# Altium project shed.PrjPcb
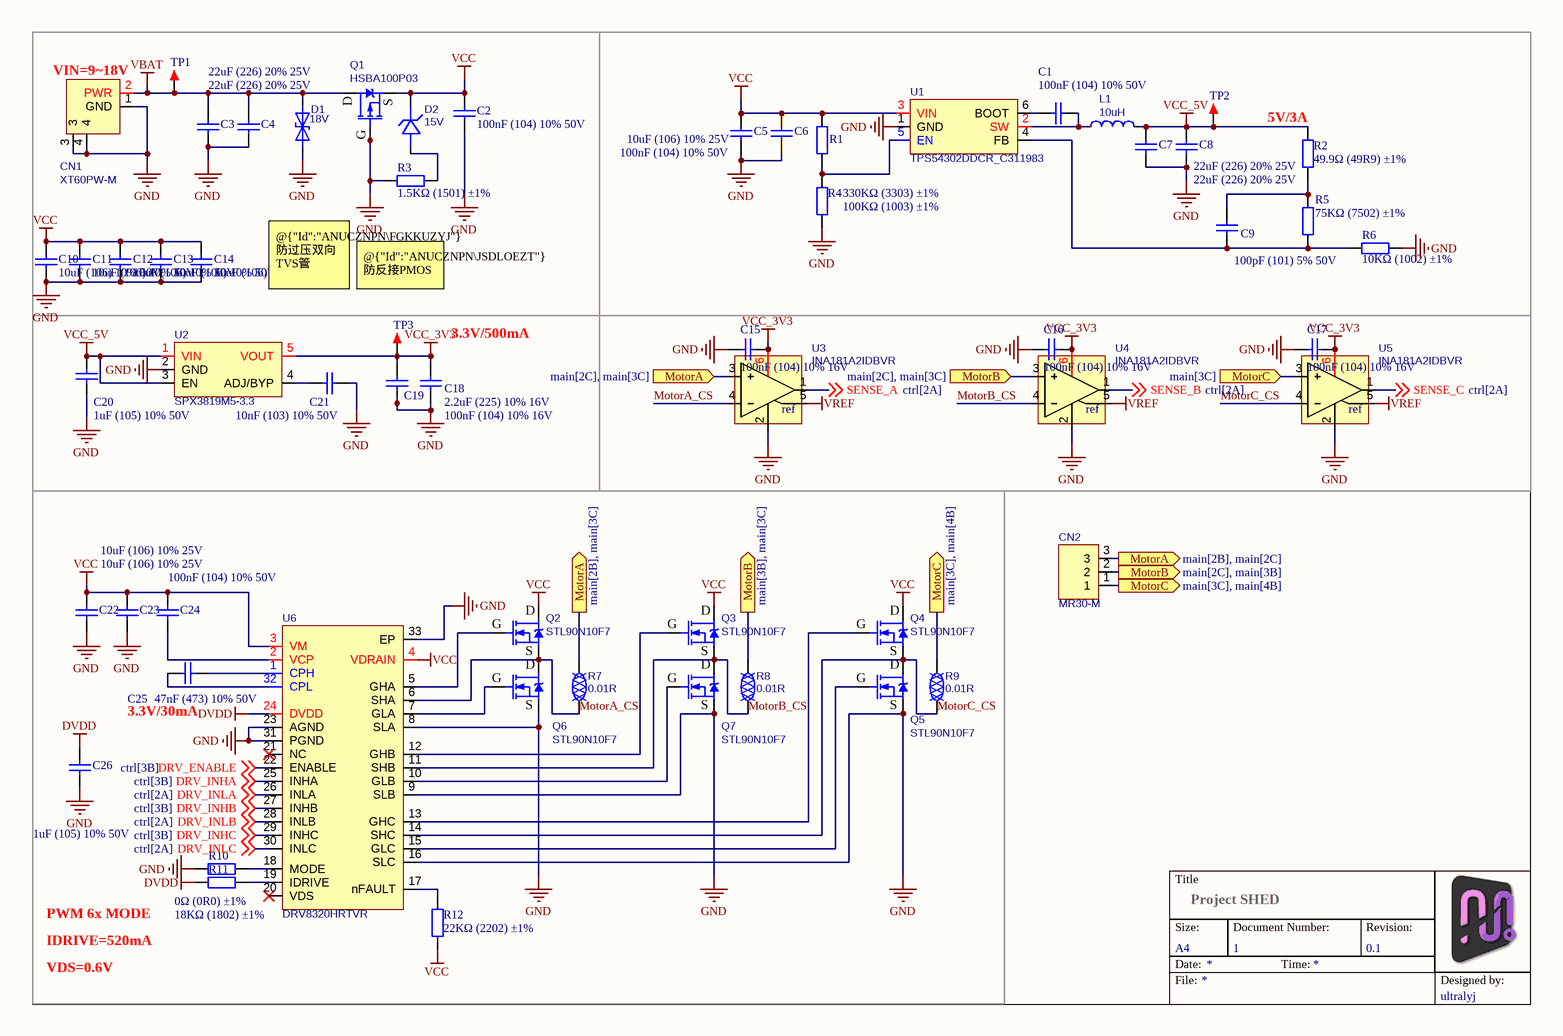
[diagram p0: main.SchDoc]
2 sheets, 110 parts. Net scope: flat (ports and power ports of the same name join across sheets).
Board file: shed.PcbDoc
Sheets:
  main.SchDoc
  ctrl.SchDoc

## Sheet main.SchDoc: Project SHED
size A4; DrawnBy: ultralyj; DocumentNumber: 1; Revision: 0.1; SheetNumber: 1; SheetTotal: 2

### Parts
(Parts that share a designator on the sheet are numbered #1, #2 ... from top to bottom, then left to right.)
C1  100nF (104) 10% 50V  [LC-0603_C_NOSILK]
C2  100nF (104) 10% 50V  [LC-0603_C_NOSILK]
C3  22uF (226) 20% 25V  [LC-0805_C_NOSILK]
C4  22uF (226) 20% 25V  [LC-0805_C_NOSILK]
C5  10uF (106) 10% 25V  [LC-0805_C_NOSILK]
C6  100nF (104) 10% 50V  [LC-0603_C_NOSILK]
C7  22uF (226) 20% 25V  [LC-0805_C_NOSILK]
C8  22uF (226) 20% 25V  [LC-0805_C_NOSILK]
C9  100pF (101) 5% 50V  [LC-0402_C_NOSILK]
C10  10uF (106) 10% 50V  [1206_C]
C11  10uF (106) 10% 50V  [1206_C]
C12  10uF (106) 10% 50V  [1206_C]
C13  10uF (106) 10% 50V  [1206_C]
C14  10uF (106) 10% 50V  [1206_C]
C15  100nF (104) 10% 16V  [LC-0402_C_NOSILK]
C16  100nF (104) 10% 16V  [LC-0402_C_NOSILK]
C17  100nF (104) 10% 16V  [LC-0402_C_NOSILK]
C18  2.2uF (225) 10% 16V  [LC-0603_C_NOSILK]
C19#1  100nF (104) 10% 16V  [LC-0402_C_NOSILK]
C20#1  1uF (105) 10% 50V  [LC-0603_C_NOSILK]
C21#1  10nF (103) 10% 50V  [LC-0402_C_NOSILK]
C22#1  10uF (106) 10% 25V  [LC-0805_C_NOSILK]
C23#1  10uF (106) 10% 25V  [LC-0805_C_NOSILK]
C24#1  100nF (104) 10% 50V  [LC-0603_C_NOSILK]
C25#1  47nF (473) 10% 50V  [LC-0603_C_NOSILK]
C26#1  1uF (105) 10% 50V  [LC-0603_C_NOSILK]
CN1  XT60PW-M  [CONN-TH_XT60PW-M]
CN2  MR30-M  [AMASS-MR30-M]
D1  18V  [SMB_L4.6-W3.6-LS5.3-BI]
D2  15V  [SOD-323_L1.8-W1.3-LS2.5-RD]
L1  10uH  [IND-SMD_L5.4-W5.2]
Q1  HSBA100P03  [DFN-8_L5.7-W5.1-P1.27-LS6.1-BL]
Q2  STL90N10F7  [POWERFLAT-8_L5.2-W6.0-P1.27-LS6.2-BL]
Q3  STL90N10F7  [POWERFLAT-8_L5.2-W6.0-P1.27-LS6.2-BL]
Q4  STL90N10F7  [POWERFLAT-8_L5.2-W6.0-P1.27-LS6.2-BL]
Q5  STL90N10F7  [POWERFLAT-8_L5.2-W6.0-P1.27-LS6.2-BL]
Q6  STL90N10F7  [POWERFLAT-8_L5.2-W6.0-P1.27-LS6.2-BL]
Q7  STL90N10F7  [POWERFLAT-8_L5.2-W6.0-P1.27-LS6.2-BL]
R1  330KΩ (3303) ±1%  [LC-0402_R_NOSILK]
R2  49.9Ω (49R9) ±1%  [LC-0402_R_NOSILK]
R3  1.5KΩ (1501) ±1%  [LC-0402_R_NOSILK]
R4  100KΩ (1003) ±1%  [LC-0402_R_NOSILK]
R5  75KΩ (7502) ±1%  [LC-0402_R_NOSILK]
R6  10KΩ (1002) ±1%  [LC-0402_R_NOSILK]
R7  0.01R  [RES-SMD_L6.4-W3.2_RLP25]
R8  0.01R  [RES-SMD_L6.4-W3.2_RLP25]
R9  0.01R  [RES-SMD_L6.4-W3.2_RLP25]
R10  0Ω (0R0) ±1%  [LC-0402_R_NOSILK]
R11  18KΩ (1802) ±1%  [LC-0402_R_NOSILK]
R12  22KΩ (2202) ±1%  [LC-0402_R_NOSILK]
TP1  TEST  [TEST 1.6]  (value not drawn)
TP2  TEST  [TEST 1.6]  (value not drawn)
TP3  TEST  [TEST 1.6]  (value not drawn)
U1  TPS54302DDCR_C311983  [SOT-23-6_L2.9-W1.6-P0.95-LS2.8-BL]
U2  SPX3819M5-3.3  [SOT-23-5_L2.9-W1.6-P0.95-LS2.8-BL]
U3  INA181A2IDBVR  [SOT-23-6_L2.9-W1.6-P0.95-LS2.8-BL]
U4  INA181A2IDBVR  [SOT-23-6_L2.9-W1.6-P0.95-LS2.8-BL]
U5  INA181A2IDBVR  [SOT-23-6_L2.9-W1.6-P0.95-LS2.8-BL]
U6  DRV8320HRTVR  [QFN-32_L5.0-W5.0-P0.50-TL-EP3.5]

### Blocks framed on the sheet
VIN=9~18V: C2-C4 C10-C14 CN1 D1 D2 Q1 R3 TP1
5V/3A: C1 C5-C9 L1 R1 R2 R4-R6 TP2 U1
3.3V/500mA: C18 C19#1 C20#1 C21#1 TP3 U2

### Ports
MotorA (in, see main[2C], main[3C]), MotorA (out, see main[2B], main[2C]), MotorA (out, see main[2B], main[3C]), MotorB (in, see main[2C], main[3C]), MotorB (out, see main[2C], main[3B]), MotorB (out, see main[3B], main[3C]), MotorC (in, see main[3C]), MotorC (out, see main[3C], main[4B])

### Nets
DVDD: C26#1.2 R11.1 U6.24(DVDD)
GND: C2.1 C3.1 C4.1 C5.1 C6.1 C7.1 C8.1 C10.1 C11.1 C12.1 C13.1 C14.1 C15.1 C16.1 C17.1 C18.1 C19#1.1 C20#1.1 C21#1.2 C22#1.1 C23#1.1 C26#1.1 CN1.1(GND) CN1.3 CN1.4 D1.1 Q1.4(G) Q5.1,2,3(S) Q6.1,2,3(S) Q7.1,2,3(S) R3.1 R4.1 R6.1 R10.1 U1.1(GND) U2.2(GND) U3.2(GND) U4.2(GND) U5.2(GND) U6.8(SLA) U6.9(SLB) U6.16(SLC) U6.23(AGND) U6.31(PGND) U6.33(EP)
VBAT: C3.2 C4.2 CN1.2(PWR) D1.2 Q1.5,6,7,8,9(D) TP1.1
VCC: C2.2 C5.2 C6.2 C10.2 C11.2 C12.2 C13.2 C14.2 C22#1.2 C23#1.2 C24#1.2 D2.1 Q1.1,2,3(S) Q2.5,6,7,8(D) Q3.5,6,7,8(D) Q4.5,6,7,8(D) R1.2 R12.2 U1.3(VIN) U6.3(VM) U6.4(VDRAIN)
VCC_3V3: C15.2 C16.2 C17.2 C18.2 C19#1.2 TP3.1 U2.5(VOUT) U3.6(VS) U4.6(VS) U5.6(VS)
VCC_5V: C7.2 C8.2 C20#1.2 L1.2 R2.2 TP2.1 U2.1(VIN) U2.3(EN)
VREF: U3.5(REF) U4.5(REF) U5.5(REF)
DRV_ENABLE: U6.22(ENABLE) ; off-sheet DRV_ENABLE
DRV_INHA: U6.25(INHA) ; off-sheet DRV_INHA
DRV_INHB: U6.27(INHB) ; off-sheet DRV_INHB
DRV_INHC: U6.29(INHC) ; off-sheet DRV_INHC
DRV_INLA: U6.26(INLA) ; off-sheet DRV_INLA
DRV_INLB: U6.28(INLB) ; off-sheet DRV_INLB
DRV_INLC: U6.30(INLC) ; off-sheet DRV_INLC
MotorA_CS: Q2.1,2,3(S) Q6.5,6,7,8(D) R7.1 U3.4(IN-) U6.6(SHA)
MotorB_CS: Q3.1,2,3(S) Q7.5,6,7,8(D) R8.1 U4.4(IN-) U6.11(SHB)
MotorC_CS: Q4.1,2,3(S) Q5.5,6,7,8(D) R9.2 U5.4(IN-) U6.14(SHC)
SENSE_A: U3.1(OUT) ; off-sheet SENSE_A
SENSE_B: U4.1(OUT) ; off-sheet SENSE_B
SENSE_C: U5.1(OUT) ; off-sheet SENSE_C
NetC1_1: C1.1 U1.6(BOOT)
NetC1_2: C1.2 L1.1 U1.2(SW)
NetC9_1: C9.1 R5.1 R6.2 U1.4(FB)
NetC9_2: C9.2 R2.1 R5.2
NetC21#1_1: C21#1.1 U2.4(ADJ/BYP)
NetC24#1_1: C24#1.1 U6.2(VCP)
NetC25#1_1: C25#1.1 U6.32(CPL)
NetC25#1_2: C25#1.2 U6.1(CPH)
NetCN2_1: CN2.1 R9.1 U5.3(IN+) ; port MotorC
NetCN2_2: CN2.2 R8.2 U4.3(IN+) ; port MotorB
NetCN2_3: CN2.3 R7.2 U3.3(IN+) ; port MotorA
NetD2_2: D2.2 R3.2
NetQ2_4: Q2.4(G) U6.5(GHA)
NetQ3_4: Q3.4(G) U6.12(GHB)
NetQ4_4: Q4.4(G) U6.13(GHC)
NetQ5_4: Q5.4(G) U6.15(GLC)
NetQ6_4: Q6.4(G) U6.7(GLA)
NetQ7_4: Q7.4(G) U6.10(GLB)
NetR1_1: R1.1 R4.2 U1.5(EN)
NetR10_2: R10.2 U6.18(MODE)
NetR11_2: R11.2 U6.19(IDRIVE)
NetR12_1: R12.1 U6.17(nFAULT)

Not connected (* = marked no-connect by the designer): U6 20(VDS)* 21(NC)*

### Notes on the sheet
- @{"Id":"ANUCZNPN\FGKKUZYJ"} 防过压双向TVS管
- @{"Id":"ANUCZNPN\JSDLOEZT"} 防反接PMOS
- (near C25#1) 3.3V/30mA
- PWM 6x MODE
- IDRIVE=520mA
- VDS=0.6V
- Title
- Size:
- A4
- Date:
- File:
- Document Number:
- Time:
- Revision:
- Designed by:
- (in symbol INA181A2IDBVR) ref

### Library data of the parts
C1 C2 C6 C24#1 = 0603 100nF (104) 10% 50V: 贴片电容; ComponentLink1Description: 供应商链接; ComponentLink1URL: http://www.szlcsc.com/product/details_15331.html; Package: 0603; Supplier: LC; SuppliersPartNumber: C14663
C3 C4 C7 C8 = 0805 22uF (226) 20% 25V: 贴片电容; ComponentLink1Description: 供应商链接; ComponentLink1URL: http://www.szlcsc.com/product/details_46786.html; Package: 0805; Supplier: LC; SuppliersPartNumber: C45783
C5 C22#1 C23#1 = 0805 10uF (106) 10% 25V: 贴片电容; ComponentLink1Description: 供应商链接; ComponentLink1URL: http://www.szlcsc.com/product/details_16532.html; Package: 0805; Supplier: LC; SuppliersPartNumber: C15850
C9 = 0402 100pF (101) 5% 50V: 贴片电容; ComponentLink1Description: 供应商链接; ComponentLink1URL: http://www.szlcsc.com/product/details_1898.html; Package: 0402; Supplier: LC; SuppliersPartNumber: C1546
C10-C14 = 1206 10uF (106) 10% 50V: 贴片电容; ComponentLink1Description: 供应商链接; ComponentLink1URL: http://www.szlcsc.com/product/details_14236.html; Package: 1206; Supplier: LC; SuppliersPartNumber: C13585
C15-C17 C19#1 = 0402 100nF (104) 10% 16V: 贴片电容; ComponentLink1Description: 供应商链接; ComponentLink1URL: http://www.szlcsc.com/product/details_1877.html; Package: 0402; Supplier: LC; SuppliersPartNumber: C1525
C18 = 0603 2.2uF (225) 10% 16V: 贴片电容; ComponentLink1Description: 供应商链接; ComponentLink1URL: http://www.szlcsc.com/product/details_24366.html; Package: 0603; Supplier: LC; SuppliersPartNumber: C23630
C20#1 C26#1 = 0603 1uF (105) 10% 50V: 贴片电容; ComponentLink1Description: 供应商链接; ComponentLink1URL: http://www.szlcsc.com/product/details_16531.html; Package: 0603; Supplier: LC; SuppliersPartNumber: C15849
C21#1 = 0402 10nF (103) 10% 50V: 贴片电容; ComponentLink1Description: 供应商链接; ComponentLink1URL: http://www.szlcsc.com/product/details_15869.html; Package: 0402; Supplier: LC; SuppliersPartNumber: C15195
C25#1 = 0603 47nF (473) 10% 50V: 贴片电容; ComponentLink1Description: 供应商链接; ComponentLink1URL: http://www.szlcsc.com/product/details_1974.html; Package: 0603; Supplier: LC; SuppliersPartNumber: C1622
CN1 = XT60PW-M: 电源插座; BOM_Manufacturer: AMASS(艾迈斯); Contributor: LCSC; BOM_Supplier: LCSC; BOM_Supplier Part: C98732; BOM_Manufacturer Part: XT60PW-M; BOM_JLCPCB Part Class: Extended Part; spicePre: C; spiceSymbolName: XT60PW-M
CN2 = MR30-M: 三芯XT插头连接器Male; BOM_Manufacturer: AMASS(艾迈斯); Contributor: lcsc; BOM_Supplier: LCSC; BOM_Supplier Part: C99873; BOM_Manufacturer Part: MR30-M; link: https://atta.szlcsc.com/upload/public/pdf/source/20170412/1491969315720.pdf; BOM_JLCPCB Part Class: Extended Part; spicePre: U; spiceSymbolName: MR30-M
D1 = SMBJ18CA-C78413: 双向18V TVS管; BOM_Manufacturer Part: SMBJ18CA/TR13; BOM_Manufacturer: Brightking(君耀电子); BOM_Supplier: LCSC; BOM_Supplier Part: C78413; BOM_JLCPCB Part Class: Extended Part; spicePre: D; spiceSymbolName: SMBJ18CA-C78413
D2 = PTVSHC3D15VUH: 15V TVS管; BOM_Manufacturer: Prisemi(芯导); Contributor: LCSC; BOM_Supplier: LCSC; BOM_Supplier Part: C312234; BOM_Manufacturer Part: PTVSHC3D15VUH; BOM_JLCPCB Part Class: Extended Part; spicePre: D; spiceSymbolName: PTVSHC3D15VUH
L1 = 10uH: YSPI0530-100M 2.5A功率电感; BOM_Manufacturer: YJYCOIN(益嘉源); nameAlias: Inductance; Contributor: LCSC; BOM_Supplier: LCSC; BOM_Supplier Part: C351099; BOM_Manufacturer Part: YSPI0530-100M; BOM_JLCPCB Part Class: Extended Part; spicePre: L; spiceSymbolName: YSPI0530-100M
Q1 = HSBA100P03: P-Channel Mosfet Vdss=30V Id=100A; BOM_Manufacturer: HUASHUO(华朔); Contributor: LCSC; BOM_Supplier: LCSC; BOM_Supplier Part: C701057; BOM_Manufacturer Part: HSBA100P03; BOM_JLCPCB Part Class: Extended Part; spicePre: Q; spiceSymbolName: HSBA100P03
Q2-Q7 = STL90N10F7: N-Channel Mosfet Vdss=100V Id=70A; BOM_Manufacturer: ST(意法半导体); Contributor: LCSC; BOM_Supplier: LCSC; BOM_Supplier Part: C457493; BOM_Manufacturer Part: STL90N10F7; BOM_JLCPCB Part Class: Extended Part; spicePre: Q; spiceSymbolName: STL90N10F7
R1 = 0402 330KΩ (3303) 1%: 贴片电阻; ComponentLink1Description: 供应商链接; ComponentLink1URL: http://www.szlcsc.com/product/details_26521.html; Package: 0402; Supplier: LC; SuppliersPartNumber: C25778
R2 = 0402 49.9Ω (49R9) 1%: 贴片电阻; ComponentLink1Description: 供应商链接; ComponentLink1URL: http://www.szlcsc.com/product/details_25863.html; Package: 0402; Supplier: LC; SuppliersPartNumber: C25120
R3 = 0402 1.5KΩ (1501) 1%: 贴片电阻; ComponentLink1Description: 供应商链接; ComponentLink1URL: http://www.szlcsc.com/product/details_26610.html; Package: 0402; Supplier: LC; SuppliersPartNumber: C25867
R4 = 0402 100KΩ (1003) 1%: 贴片电阻; ComponentLink1Description: 供应商链接; ComponentLink1URL: http://www.szlcsc.com/product/details_26484.html; Package: 0402; Supplier: LC; SuppliersPartNumber: C25741
R5 = 0402 75KΩ (7502) 1%: 贴片电阻; ComponentLink1Description: 供应商链接; ComponentLink1URL: http://www.szlcsc.com/product/details_26541.html; Package: 0402; Supplier: LC; SuppliersPartNumber: C25798
R6 = 0402 10KΩ (1002) 1%: 贴片电阻; ComponentLink1Description: 供应商链接; ComponentLink1URL: http://www.szlcsc.com/product/details_26487.html; Package: 0402; Supplier: LC; SuppliersPartNumber: C25744
R7-R9 = PA2512FKF7T0R001E: 0.01欧姆采样电阻 3W; BOM_Manufacturer: YAGEO(国巨); Contributor: lcsc; BOM_Supplier: LCSC; BOM_Supplier Part: C723380; BOM_Manufacturer Part: PA2512FKF7T0R001E; Resistance: -; BOM_JLCPCB Part Class: Extended Part; spicePre: R; spiceSymbolName: PA2512FKF7T0R001E
R10 = 0402 0Ω (0R0) 1%: 贴片电阻; ComponentLink1Description: 供应商链接; ComponentLink1URL: http://www.szlcsc.com/product/details_17853.html; Package: 0402; Supplier: LC; SuppliersPartNumber: C17168
R11 = 0402 18KΩ (1802) 1%: 贴片电阻; ComponentLink1Description: 供应商链接; ComponentLink1URL: http://www.szlcsc.com/product/details_26505.html; Package: 0402; Supplier: LC; SuppliersPartNumber: C25762
R12 = 0402 22KΩ (2202) 1%: 贴片电阻; ComponentLink1Description: 供应商链接; ComponentLink1URL: http://www.szlcsc.com/product/details_26511.html; Package: 0402; Supplier: LC; SuppliersPartNumber: C25768
TP1-TP3 = TEST: 测试点; 版权归属: 源创客; BOM名称: 测试点; 学习资源: www.ooocke.com
U1 = TPS54302DDCR_C311983: DC-DC芯片 Vin=4.5V~28V Vout=596mV~28V Imax=3A; BOM_Manufacturer: TI(德州仪器); Contributor: LCSC; BOM_Supplier: LCSC; BOM_Supplier Part: C311983; BOM_Manufacturer Part: TPS54302DDCR; BOM_JLCPCB Part Class: Extended Part; spicePre: U; spiceSymbolName: TPS54302DDCR_C311983
U2 = SPX3819M5-3.3: Vin=16V Vout=3.3V 500mA LDO; BOM_Manufacturer: null; Contributor: lcsc; BOM_Supplier: LCSC; BOM_Supplier Part: C9900018941; BOM_Manufacturer Part: SPX3819M5-3.3; BOM_JLCPCB Part Class: Extended Part; spicePre: U; spiceSymbolName: SPX3819M5-3.3
U3-U5 = INA181A2IDBVR: 26V、双向、350kHz 电流感应放大器; BOM_Manufacturer: TI(德州仪器); Contributor: lcsc; BOM_Supplier: LCSC; BOM_Supplier Part: C2058784; BOM_Manufacturer Part: INA181A2IDBVR; BOM_JLCPCB Part Class: Extended Part; spicePre: U; spiceSymbolName: INA181A2IDBVR
U6 = DRV8320HRTVR: 最大 65V 三相智能栅极驱动器; BOM_Manufacturer: TI(德州仪器); Contributor: LCSC; BOM_Supplier: LCSC; BOM_Supplier Part: C701782; BOM_Manufacturer Part: DRV8320HRTVR; BOM_JLCPCB Part Class: Extended Part; spicePre: U; spiceSymbolName: DRV8320HRTVR

## Sheet ctrl.SchDoc: Project SHED
size A4; DrawnBy: ultralyj; DocumentNumber: 2; Revision: 0.1; SheetNumber: 2; SheetTotal: 2
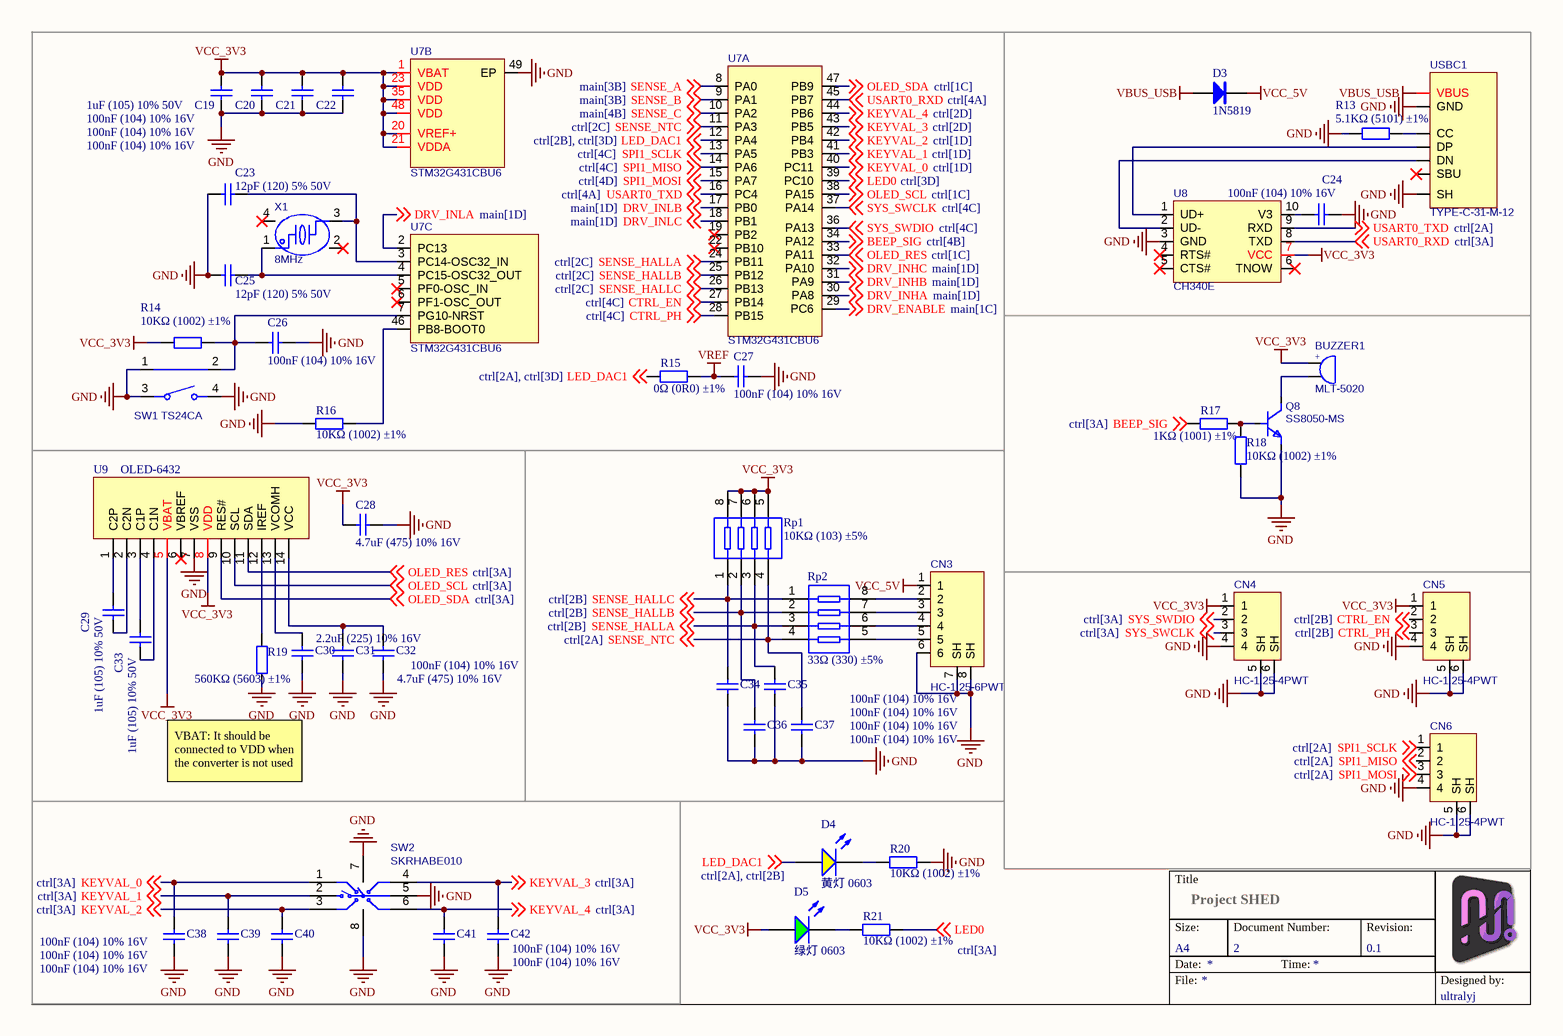
[diagram p1: ctrl.SchDoc]

### Parts
(Parts that share a designator on the sheet are numbered #1, #2 ... from top to bottom, then left to right.)
BUZZER1  MLT-5020  [BUZ-SMD_L5.0-W5.5-P4.60]
C19#2  1uF (105) 10% 50V  [LC-0603_C_NOSILK]
C20#2  100nF (104) 10% 16V  [LC-0402_C_NOSILK]
C21#2  100nF (104) 10% 16V  [LC-0402_C_NOSILK]
C22#2  100nF (104) 10% 16V  [LC-0402_C_NOSILK]
C23#2  12pF (120) 5% 50V  [LC-0402_C_NOSILK]
C24#2  100nF (104) 10% 16V  [LC-0402_C_NOSILK]
C25#2  12pF (120) 5% 50V  [LC-0402_C_NOSILK]
C26#2  100nF (104) 10% 16V  [LC-0402_C_NOSILK]
C27  100nF (104) 10% 16V  [LC-0402_C_NOSILK]
C28  4.7uF (475) 10% 16V  [LC-0603_C_NOSILK]
C29  1uF (105) 10% 50V  [LC-0603_C_NOSILK]
C30  2.2uF (225) 10% 16V  [LC-0603_C_NOSILK]
C31  4.7uF (475) 10% 16V  [LC-0603_C_NOSILK]
C32  100nF (104) 10% 16V  [LC-0402_C_NOSILK]
C33  1uF (105) 10% 50V  [LC-0603_C_NOSILK]
C34  100nF (104) 10% 16V  [LC-0402_C_NOSILK]
C35  100nF (104) 10% 16V  [LC-0402_C_NOSILK]
C36  100nF (104) 10% 16V  [LC-0402_C_NOSILK]
C37  100nF (104) 10% 16V  [LC-0402_C_NOSILK]
C38  100nF (104) 10% 16V  [LC-0402_C_NOSILK]
C39  100nF (104) 10% 16V  [LC-0402_C_NOSILK]
C40  100nF (104) 10% 16V  [LC-0402_C_NOSILK]
C41  100nF (104) 10% 16V  [LC-0402_C_NOSILK]
C42  100nF (104) 10% 16V  [LC-0402_C_NOSILK]
CN3  HC-1.25-6PWT  [CONN-SMD_6P-P1.25_HC-1.25-6PWT]
CN4  HC-1.25-4PWT  [CONN-SMD_4P-P1.25-HC-1.25-4PWT]
CN5  HC-1.25-4PWT  [CONN-SMD_4P-P1.25-HC-1.25-4PWT]
CN6  HC-1.25-4PWT  [CONN-SMD_4P-P1.25-HC-1.25-4PWT]
D3  1N5819  [SOD-323]
D4  黄灯 0603  [0603_LED_S1]
D5  绿灯 0603  [0603_LED_S1]
Q8  SS8050-MS  [SOT-23-3_L2.9-W1.3-P0.95-LS2.4-BR]
R13  5.1KΩ (5101) ±1%  [LC-0402_R_NOSILK]
R14  10KΩ (1002) ±1%  [LC-0402_R_NOSILK]
R15  0Ω (0R0) ±1%  [LC-0402_R_NOSILK]
R16  10KΩ (1002) ±1%  [LC-0402_R_NOSILK]
R17  1KΩ (1001) ±1%  [0402_R]
R18  10KΩ (1002) ±1%  [0402_R]
R19  560KΩ (5603) ±1%  [LC-0603_R_NOSILK]
R20  10KΩ (1002) ±1%  [LC-0402_R_NOSILK]
R21  10KΩ (1002) ±1%  [0402_R]
Rp1  10KΩ (103) ±5%  [0402_Rx4]
Rp2  33Ω (330) ±5%  [0402_Rx4]
SW1  TS24CA  [SW-SMD_TS24CA]
SW2  SKRHABE010  [SW-SMD_SKRHABE010]
U7  STM32G431CBU6  [UFQFPN-48_L7.0-W7.0-P0.50-BL-EP]  (parts A,B,C of 3)
U8  CH340E  [MSOP-10_L3.0-W3.0-P0.50-LS5.0-BL]
U9  OLED-6432  [OLED-6432-TOP]
USBC1  TYPE-C-31-M-12  [USB-C_SMD-TYPE-C-31-M-12]
X1  8MHz  [CRYSTAL-SMD_4P-L3.2-W2.5-BL]

### Nets
GND: C19#2.1 C20#2.1 C21#2.1 C22#2.1 C23#2.1 C24#2.2 C25#2.1 C26#2.2 C27.2 C28.1 C30.1 C31.1 C32.1 C34.1 C35.1 C36.1 C37.1 C38.1 C39.1 C40.1 C41.1 C42.1 CN3.6 CN3.7(SH) CN3.8(SH) CN4.4 CN4.5(SH) CN4.6(SH) CN5.4 CN5.5(SH) CN5.6(SH) CN6.4 CN6.5(SH) CN6.6(SH) Q8.2(E) R13.1 R16.1 R18.1 R19.1 R20.2 SW1.1 SW1.3 SW1.4 SW2.5(COM) SW2.7 SW2.8 U7.49(EP) U8.3(GND) U9.7(VSS) USBC1.0,1,2,3(SH) USBC1.A1,B1,A12,B12(GND)
VBUS_USB: D3.1(A) USBC1.A4,A9,B4,B9(VBUS)
VCC_3V3: BUZZER1.1 C19#2.2 C20#2.2 C21#2.2 C22#2.2 C28.2 CN4.1 CN5.1 D5.A R14.1 Rp1.5 Rp1.6 Rp1.7 Rp1.8 U7.1(VBAT) U7.20(VREF+) U7.21(VDDA) U7.23(VDD) U7.35(VDD) U7.48(VDD) U8.7(VCC) U9.5(VBAT) U9.8(VDD)
VCC_5V: CN3.1 D3.2(K)
VREF: C27.1 R15.2
BEEP_SIG: R17.1 U7.34(PA12) ; off-sheet BEEP_SIG
CTRL_EN: CN5.2 U7.27(PB14) ; off-sheet CTRL_EN
CTRL_PH: CN5.3 U7.28(PB15) ; off-sheet CTRL_PH
DRV_ENABLE: U7.29(PC6) ; off-sheet DRV_ENABLE
DRV_INHA: U7.30(PA8) ; off-sheet DRV_INHA
DRV_INHB: U7.31(PA9) ; off-sheet DRV_INHB
DRV_INHC: U7.32(PA10) ; off-sheet DRV_INHC
DRV_INLA: U7.2(PC13) ; off-sheet DRV_INLA
DRV_INLB: U7.17(PB0) ; off-sheet DRV_INLB
DRV_INLC: U7.18(PB1) ; off-sheet DRV_INLC
KEYVAL_0: C38.2 SW2.1(A) U7.40(PC11) ; off-sheet KEYVAL_0
KEYVAL_1: C39.2 SW2.2(CEN) U7.41(PB3) ; off-sheet KEYVAL_1
KEYVAL_2: C40.2 SW2.3(C) U7.42(PB4) ; off-sheet KEYVAL_2
KEYVAL_3: C42.2 SW2.4(D) U7.43(PB5) ; off-sheet KEYVAL_3
KEYVAL_4: C41.2 SW2.6(B) U7.44(PB6) ; off-sheet KEYVAL_4
LED0: R21.2 U7.39(PC10) ; off-sheet LED0
LED_DAC1: D4.A R15.1 U7.12(PA4) ; off-sheet LED_DAC1
OLED_RES: U7.33(PA11) U9.11(SDA) ; off-sheet OLED_RES
OLED_SCL: U7.38(PA15) U9.10(SCL) ; off-sheet OLED_SCL
OLED_SDA: U7.47(PB9) U9.9(RES#) ; off-sheet OLED_SDA
SENSE_A: U7.8(PA0) ; off-sheet SENSE_A
SENSE_B: U7.9(PA1) ; off-sheet SENSE_B
SENSE_C: U7.10(PA2) ; off-sheet SENSE_C
SENSE_HALLA: C35.2 Rp1.3 Rp2.3 U7.24(PB11) ; off-sheet SENSE_HALLA
SENSE_HALLB: C36.2 Rp1.2 Rp2.2 U7.25(PB12) ; off-sheet SENSE_HALLB
SENSE_HALLC: C34.2 Rp1.1 Rp2.1 U7.26(PB13) ; off-sheet SENSE_HALLC
SENSE_NTC: C37.2 Rp1.4 Rp2.4 U7.11(PA3) ; off-sheet SENSE_NTC
SPI1_MISO: CN6.2 U7.14(PA6) ; off-sheet SPI1_MISO
SPI1_MOSI: CN6.3 U7.15(PA7) ; off-sheet SPI1_MOSI
SPI1_SCLK: CN6.1 U7.13(PA5) ; off-sheet SPI1_SCLK
SYS_SWCLK: CN4.3 U7.37(PA14) ; off-sheet SYS_SWCLK
SYS_SWDIO: CN4.2 U7.36(PA13) ; off-sheet SYS_SWDIO
USART0_RXD: U7.45(PB7) U8.8(TXD) ; off-sheet USART0_RXD
USART0_TXD: U7.16(PC4) U8.9(RXD) ; off-sheet USART0_TXD
NetBUZZER1_2: BUZZER1.2 Q8.3(C)
NetC23#2_2: C23#2.2 U7.3(PC14-OSC32_IN) X1.3
NetC24#2_1: C24#2.1 U8.10(V3)
NetC25#2_2: C25#2.2 U7.4(PC15-OSC32_OUT) X1.1
NetC26#2_1: C26#2.1 R14.2 SW1.2 U7.7(PG10-NRST)
NetC29_1: C29.1 U9.2(C2N)
NetC29_2: C29.2 U9.1(C2P)
NetC30_2: C30.2 U9.13(VCOMH)
NetC31_2: C31.2 C32.2 U9.14(VCC)
NetC33_1: C33.1 U9.4(C1N)
NetC33_2: C33.2 U9.3(C1P)
NetCN3_2: CN3.2 Rp2.8
NetCN3_3: CN3.3 Rp2.7
NetCN3_4: CN3.4 Rp2.6
NetCN3_5: CN3.5 Rp2.5
NetD4_K: D4.K R20.1
NetD5_K: D5.K R21.1
NetQ8_1: Q8.1(B) R17.2 R18.2
NetR13_2: R13.2 USBC1.A5,B5(CC)
NetR16_2: R16.2 U7.46(PB8-BOOT0)
NetR19_2: R19.2 U9.12(IREF)
NetU8_1: U8.1(UD+) USBC1.A6,B6(DP)
NetU8_2: U8.2(UD-) USBC1.A7,B7(DN)

Not connected (* = marked no-connect by the designer): U7 5(PF0-OSC_IN)* 6(PF1-OSC_OUT)* 19(PB2)* 22(PB10)*; U8 4(RTS#)* 5(CTS#)* 6(TNOW)*; U9 6(VBREF)*; USBC1 A8,B8(SBU)*; X1 2(GND)* 4(GND)*

### Notes on the sheet
- VBAT: It should be connected to VDD when the converter is not used
- Title
- Size:
- A4
- Date:
- File:
- Document Number:
- Time:
- Revision:
- Designed by:
- (in symbol MLT-5020) +

### Library data of the parts
BUZZER1 = MLT-5020: 薄款贴片无源蜂鸣器; BOM_Manufacturer: 华能; Frequency: 4000Hz; BOM_Supplier: LCSC; BOM_Manufacturer Part: MLT-5020; BOM_Supplier Part: C94598; BOM_JLCPCB Part Class: Extended Part; spicePre: B; spiceSymbolName: MLT-5020
C19#2 C29 C33 = 0603 1uF (105) 10% 50V: 贴片电容; ComponentLink1Description: 供应商链接; ComponentLink1URL: http://www.szlcsc.com/product/details_16531.html; Package: 0603; Supplier: LC; SuppliersPartNumber: C15849
C20#2 C21#2 C22#2 C24#2 C26#2 C27 C32 C34-C42 = 0402 100nF (104) 10% 16V: 贴片电容; ComponentLink1Description: 供应商链接; ComponentLink1URL: http://www.szlcsc.com/product/details_1877.html; Package: 0402; Supplier: LC; SuppliersPartNumber: C1525
C23#2 C25#2 = 0402 12pF (120) 5% 50V: 贴片电容; ComponentLink1Description: 供应商链接; ComponentLink1URL: http://www.szlcsc.com/product/details_1899.html; Package: 0402; Supplier: LC; SuppliersPartNumber: C1547
C28 C31 = 0603 4.7uF (475) 10% 16V: 贴片电容; ComponentLink1Description: 供应商链接; ComponentLink1URL: http://www.szlcsc.com/product/details_20375.html; Package: 0603; Supplier: LC; SuppliersPartNumber: C19666
C30 = 0603 2.2uF (225) 10% 16V: 贴片电容; ComponentLink1Description: 供应商链接; ComponentLink1URL: http://www.szlcsc.com/product/details_24366.html; Package: 0603; Supplier: LC; SuppliersPartNumber: C23630
CN3 = HC-1.25-6PWT: 1.25mm 6P 插座; BOM_Manufacturer: HCTL(华灿天禄); Contributor: LCSC; BOM_Supplier: LCSC; BOM_Supplier Part: C2845383; BOM_Manufacturer Part: HC-1.25-6PWT; BOM_JLCPCB Part Class: Extended Part; spicePre: C; spiceSymbolName: HC-1.25-6PWT
CN4-CN6 = HC-1.25-4PWT: 1.25mm 4P 插座; BOM_Manufacturer: HCTL(华灿天禄); Contributor: LCSC; BOM_Supplier: LCSC; BOM_Supplier Part: C2845381; BOM_Manufacturer Part: HC-1.25-4PWT; BOM_JLCPCB Part Class: Extended Part; spicePre: C; spiceSymbolName: HC-1.25-4PWT
D3 = 1N5819: 肖特基二极管; 版权归属: 源创客; 属性: 40V/2A; BOM名称: 肖特基二极管; 学习资源: www.ooocke.com
D4 = 0603 黄灯: 发光二极管; ComponentLink1Description: 供应商链接; ComponentLink1URL: http://www.szlcsc.com/product/details_73147.html; Package: 0603; Supplier: LC; SuppliersPartNumber: C72038
D5 = 0603 绿灯: 发光二极管; ComponentLink1Description: 供应商链接; ComponentLink1URL: http://www.szlcsc.com/product/details_73152.html; Package: 0603; Supplier: LC; SuppliersPartNumber: C72043
Q8 = SS8050-MS: NPN BJT; BOM_Manufacturer: MSKSEMI(美森科); Contributor: lcsc; BOM_Supplier: LCSC; BOM_Supplier Part: C5120748; BOM_Manufacturer Part: SS8050-MS; link: https://atta.szlcsc.comnull; BOM_JLCPCB Part Class: Extended Part; spicePre: U; spiceSymbolName: SS8050-MS
R13 = 0402 5.1KΩ (5101) 1%: 贴片电阻; ComponentLink1Description: 供应商链接; ComponentLink1URL: http://www.szlcsc.com/product/details_26648.html; Package: 0402; Supplier: LC; SuppliersPartNumber: C25905
R14 R16 R18 R20 R21 = 0402 10KΩ (1002) 1%: 贴片电阻; ComponentLink1Description: 供应商链接; ComponentLink1URL: http://www.szlcsc.com/product/details_26487.html; Package: 0402; Supplier: LC; SuppliersPartNumber: C25744
R15 = 0402 0Ω (0R0) 1%: 贴片电阻; ComponentLink1Description: 供应商链接; ComponentLink1URL: http://www.szlcsc.com/product/details_17853.html; Package: 0402; Supplier: LC; SuppliersPartNumber: C17168
R17 = 0402 1KΩ (1001) 1%: 贴片电阻; ComponentLink1Description: 供应商链接; ComponentLink1URL: http://www.szlcsc.com/product/details_12256.html; Package: 0402; Supplier: LC; SuppliersPartNumber: C11702
R19 = 0603 560KΩ (5603) 1%: 贴片电阻; ComponentLink1Description: 供应商链接; ComponentLink1URL: http://www.szlcsc.com/product/details_23930.html; Package: 0603; Supplier: LC; SuppliersPartNumber: C23203
Rp1 = 0402*4 10KΩ (103) 5%: 贴片排阻; ComponentLink1Description: 供应商链接; ComponentLink1URL: http://www.szlcsc.com/product/details_26468.html; Package: 0402*4; Supplier: LC; SuppliersPartNumber: C25725
Rp2 = 0402*4 33Ω (330) 5%: 贴片排阻; ComponentLink1Description: 供应商链接; ComponentLink1URL: http://www.szlcsc.com/product/details_26244.html; Package: 0402*4; Supplier: LC; SuppliersPartNumber: C25501
SW1 = TS24CA: 按键; BOM_Manufacturer: SHOU HAN(首韩); Contributor: LCSC; BOM_Supplier: LCSC; BOM_Supplier Part: C393942; BOM_Manufacturer Part: TS24CA; BOM_JLCPCB Part Class: Extended Part; spicePre: S; spiceSymbolName: TS24CA
SW2 = SKRHABE010: 五向开关; BOM_Manufacturer: ALPSALPINE(阿尔卑斯阿尔派); Contributor: LCSC; BOM_Supplier: LCSC; BOM_Manufacturer Part: SKRHABE010; BOM_Supplier Part: C139794; BOM_JLCPCB Part Class: Extended Part; spicePre: S; spiceSymbolName: SKRHABE010
U7 = STM32G431CBU6: Cortex-M4 MCU; BOM_Manufacturer: ST(意法半导体); Contributor: LCSC; BOM_Supplier: LCSC; BOM_Supplier Part: C529356; BOM_Manufacturer Part: STM32G431CBU6; BOM_JLCPCB Part Class: Extended Part; spicePre: U; spiceSymbolName: STM32G431CBU6
U8 = CH340E: ttl-usb芯片; BOM_Manufacturer: WCH(南京沁恒); BOM_Supplier: LCSC; BOM_Manufacturer Part: CH340E; BOM_Supplier Part: C99652; BOM_JLCPCB Part Class: Extended Part; spicePre: U; spiceSymbolName: CH340E
U9 = OLED-6432: 0.49inch 64-32显示屏
USBC1 = TYPE-C-31-M-12: 贴片type-c母座; BOM_Manufacturer: 韩国韩荣; Contributor: LCSC; BOM_Supplier: LCSC; BOM_Supplier Part: C165948; BOM_Manufacturer Part: TYPE-C-31-M-12; BOM_JLCPCB Part Class: Extended Part; spicePre: U; spiceSymbolName: TYPE-C-31-M-12
X1 = 8MHz: 8MHz无源晶振（负载电容12pF）; BOM_Manufacturer: JWT(晶威特); BOM_Manufacturer Part: CF4008M00012T8188031; Contributor: LCSC; nameAlias: Frequency; BOM_Supplier: LCSC; BOM_Supplier Part: C2933033; spicePre: X; spiceSymbolName: CF4008M00012T8188031

## Nets that join several sheets
GND: main (45 pins), ctrl (51 pins)
VCC_3V3: main (10 pins), ctrl (23 pins)
VCC_5V: main (8 pins), ctrl (CN3.1 D3.2)
VREF: main (U3.5 U4.5 U5.5), ctrl (C27.1 R15.2)
DRV_ENABLE: main (U6.22), ctrl (U7.29)
DRV_INHA: main (U6.25), ctrl (U7.30)
DRV_INHB: main (U6.27), ctrl (U7.31)
DRV_INHC: main (U6.29), ctrl (U7.32)
DRV_INLA: main (U6.26), ctrl (U7.2)
DRV_INLB: main (U6.28), ctrl (U7.17)
DRV_INLC: main (U6.30), ctrl (U7.18)
SENSE_A: main (U3.1), ctrl (U7.8)
SENSE_B: main (U4.1), ctrl (U7.9)
SENSE_C: main (U5.1), ctrl (U7.10)